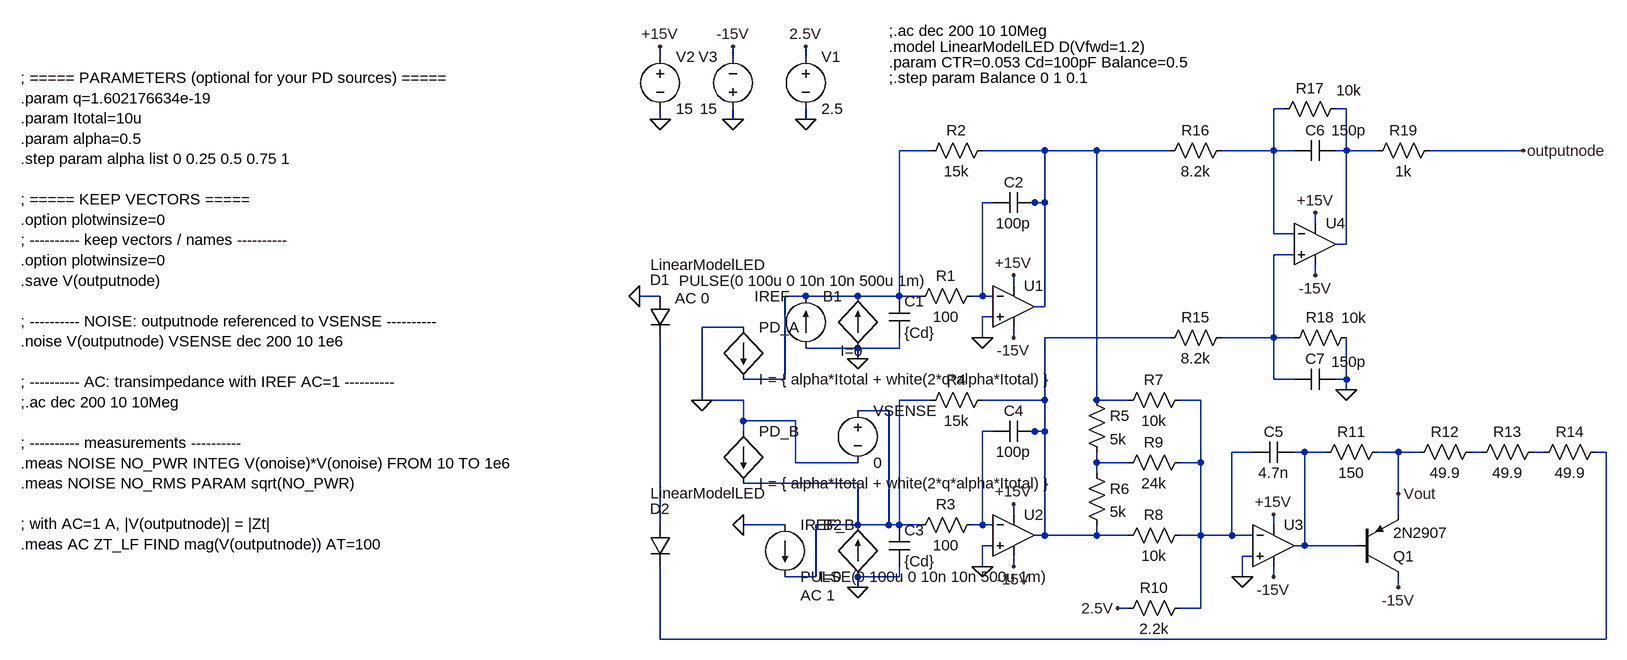
[diagram p0: schematic position-sensor-pangolin-polarity-mode-edited.asc]
position-sensor-pangolin-polarity-mode-edited.asc, the LTspice schematic file:
Version 4.1
SHEET 1 2228 1076
WIRE -144 -16 -144 -32
WIRE -32 -16 -32 -32
WIRE 80 -16 80 -32
WIRE 816 64 800 64
WIRE 912 64 896 64
WIRE -144 80 -144 64
WIRE -32 80 -32 64
WIRE 80 80 80 64
WIRE 272 128 224 128
WIRE 448 128 352 128
WIRE 528 128 448 128
WIRE 640 128 528 128
WIRE 800 128 800 64
WIRE 800 128 720 128
WIRE 832 128 800 128
WIRE 912 128 912 64
WIRE 912 128 896 128
WIRE 960 128 912 128
WIRE 1184 128 1040 128
WIRE 368 208 352 208
WIRE 432 208 416 208
WIRE 448 208 448 128
WIRE 448 208 432 208
WIRE 864 240 864 224
WIRE 800 256 800 128
WIRE 832 256 800 256
WIRE 912 272 912 128
WIRE 912 272 896 272
WIRE 832 288 800 288
WIRE 864 320 864 304
WIRE 400 336 400 320
WIRE -144 352 -176 352
WIRE 80 352 48 352
WIRE 160 352 80 352
WIRE 224 352 224 128
WIRE 224 352 160 352
WIRE 256 352 224 352
WIRE 352 352 352 208
WIRE 352 352 336 352
WIRE 368 352 352 352
WIRE 448 368 448 208
WIRE 448 368 432 368
WIRE 368 384 352 384
WIRE -16 400 -80 400
WIRE 352 416 352 384
WIRE 400 416 400 400
WIRE 640 416 448 416
WIRE 800 416 800 288
WIRE 800 416 720 416
WIRE 832 416 800 416
WIRE 160 432 80 432
WIRE 224 432 224 416
WIRE 224 432 160 432
WIRE 160 448 160 432
WIRE 48 480 48 352
WIRE 48 480 -16 480
WIRE 800 480 800 416
WIRE 832 480 800 480
WIRE 912 480 912 416
WIRE 912 480 896 480
WIRE 912 496 912 480
WIRE -80 512 -80 400
WIRE -16 512 -80 512
WIRE 272 512 224 512
WIRE 448 512 448 416
WIRE 448 512 352 512
WIRE 528 512 528 128
WIRE 576 512 528 512
WIRE 688 512 656 512
WIRE 208 528 160 528
WIRE -16 544 -16 512
WIRE 64 544 -16 544
WIRE -16 560 -16 544
WIRE 368 560 352 560
WIRE 432 560 416 560
WIRE 448 560 448 512
WIRE 448 560 432 560
WIRE 768 592 736 592
WIRE 848 592 832 592
WIRE 880 592 848 592
WIRE 992 592 960 592
WIRE 1024 592 992 592
WIRE 1120 592 1104 592
WIRE 1216 592 1200 592
WIRE 1312 592 1296 592
WIRE 64 608 64 544
WIRE 160 608 64 608
WIRE 528 608 528 592
WIRE 576 608 528 608
WIRE 688 608 688 512
WIRE 688 608 656 608
WIRE 528 624 528 608
WIRE 160 640 -16 640
WIRE 992 656 992 592
WIRE 400 688 400 672
WIRE 992 688 992 656
WIRE -144 704 -144 416
WIRE 48 704 -16 704
WIRE 160 704 160 640
WIRE 160 704 96 704
WIRE 208 704 208 528
WIRE 208 704 160 704
WIRE 224 704 224 512
WIRE 224 704 208 704
WIRE 256 704 224 704
WIRE 352 704 352 560
WIRE 352 704 336 704
WIRE 368 704 352 704
WIRE 800 704 800 688
WIRE 448 720 448 560
WIRE 448 720 432 720
WIRE 528 720 528 704
WIRE 528 720 448 720
WIRE 576 720 528 720
WIRE 688 720 688 608
WIRE 688 720 656 720
WIRE 736 720 736 592
WIRE 736 720 688 720
WIRE 768 720 736 720
WIRE 368 736 352 736
WIRE 848 736 848 592
WIRE 848 736 832 736
WIRE 928 736 848 736
WIRE 768 752 752 752
WIRE 352 768 352 736
WIRE 400 768 400 752
WIRE 96 784 96 704
WIRE 96 784 48 784
WIRE 224 784 224 768
WIRE 224 784 160 784
WIRE 752 784 752 752
WIRE 800 784 800 768
WIRE 160 800 160 784
WIRE 992 800 992 784
WIRE 576 832 560 832
WIRE 688 832 688 720
WIRE 688 832 656 832
WIRE -144 880 -144 768
WIRE 1312 880 1312 592
WIRE 1312 880 -144 880
FLAG 160 448 0
FLAG -144 80 0
FLAG -32 80 0
FLAG -144 -32 +15V
FLAG -32 -32 -15V
FLAG 400 320 +15V
FLAG 400 416 -15V
FLAG 352 416 0
FLAG 160 800 0
FLAG 400 672 +15V
FLAG 400 768 -15V
FLAG 352 768 0
FLAG -176 352 0
FLAG 80 80 0
FLAG 80 -32 2.5V
FLAG 560 832 2.5V
FLAG 800 688 +15V
FLAG 800 784 -15V
FLAG 752 784 0
FLAG 992 800 -15V
FLAG 864 224 +15V
FLAG 864 320 -15V
FLAG 912 496 0
FLAG 1184 128 outputnode
FLAG 992 656 Vout
FLAG -16 704 0
FLAG -80 512 0
DATAFLAG 448 128 ""
DATAFLAG 448 720 ""
DATAFLAG 1152 128 ""
DATAFLAG 880 736 ""
DATAFLAG 992 592 ""
DATAFLAG 1312 688 ""
DATAFLAG 1104 128 ""
SYMBOL diode -160 352 R0
WINDOW 3 1 -48 Left 2
WINDOW 0 0 -25 Left 2
SYMATTR Value LinearModelLED
SYMATTR InstName D1
SYMBOL bi 160 432 R180
WINDOW 3 -8 -4 Left 2
WINDOW 0 24 80 Left 2
SYMATTR Value I=0
SYMATTR InstName B1
SYMBOL cap 208 352 R0
SYMATTR InstName C1
SYMATTR Value {Cd}
SYMBOL OpAmps\\UniversalOpAmp 400 368 R0
SYMATTR InstName U1
SYMBOL res 352 336 R90
WINDOW 0 0 56 VBottom 2
WINDOW 3 32 56 VTop 2
SYMATTR InstName R1
SYMATTR Value 100
SYMBOL voltage -144 -32 R0
SYMATTR InstName V2
SYMATTR Value 15
SYMBOL voltage -32 80 R180
WINDOW 0 24 96 Left 2
WINDOW 3 24 16 Left 2
SYMATTR InstName V3
SYMATTR Value 15
SYMBOL res 368 112 R90
WINDOW 0 0 56 VBottom 2
WINDOW 3 32 56 VTop 2
SYMATTR InstName R2
SYMATTR Value 15k
SYMBOL cap 432 192 R90
WINDOW 0 0 32 VBottom 2
WINDOW 3 32 32 VTop 2
SYMATTR InstName C2
SYMATTR Value 100p
SYMBOL diode -160 704 R0
WINDOW 3 1 -49 Left 2
WINDOW 0 0 -25 Left 2
SYMATTR Value LinearModelLED
SYMATTR InstName D2
SYMBOL bi 160 784 R180
WINDOW 3 24 0 Left 2
WINDOW 0 24 80 Left 2
SYMATTR Value I=0
SYMATTR InstName B2
SYMBOL cap 208 704 R0
SYMATTR InstName C3
SYMATTR Value {Cd}
SYMBOL OpAmps\\UniversalOpAmp 400 720 R0
SYMATTR InstName U2
SYMBOL res 352 688 R90
WINDOW 0 0 56 VBottom 2
WINDOW 3 32 56 VTop 2
SYMATTR InstName R3
SYMATTR Value 100
SYMBOL res 368 496 R90
WINDOW 0 0 56 VBottom 2
WINDOW 3 32 56 VTop 2
SYMATTR InstName R4
SYMATTR Value 15k
SYMBOL cap 432 544 R90
WINDOW 0 0 32 VBottom 2
WINDOW 3 32 32 VTop 2
SYMATTR InstName C4
SYMATTR Value 100p
SYMBOL res 512 496 R0
SYMATTR InstName R5
SYMATTR Value 5k
SYMBOL res 512 608 R0
SYMATTR InstName R6
SYMATTR Value 5k
SYMBOL res 672 496 R90
WINDOW 0 0 56 VBottom 2
WINDOW 3 32 56 VTop 2
SYMATTR InstName R7
SYMATTR Value 10k
SYMBOL res 672 704 R90
WINDOW 0 0 56 VBottom 2
WINDOW 3 32 56 VTop 2
SYMATTR InstName R8
SYMATTR Value 10k
SYMBOL res 672 592 R90
WINDOW 0 0 56 VBottom 2
WINDOW 3 32 56 VTop 2
SYMATTR InstName R9
SYMATTR Value 24k
SYMBOL voltage 80 -32 R0
SYMATTR InstName V1
SYMATTR Value 2.5
SYMBOL res 672 816 R90
WINDOW 0 0 56 VBottom 2
WINDOW 3 32 56 VTop 2
SYMATTR InstName R10
SYMATTR Value 2.2k
SYMBOL OpAmps\\UniversalOpAmp 800 736 R0
SYMATTR InstName U3
SYMBOL cap 832 576 R90
WINDOW 0 0 32 VBottom 2
WINDOW 3 32 32 VTop 2
SYMATTR InstName C5
SYMATTR Value 4.7n
SYMBOL pnp 928 784 M180
SYMATTR InstName Q1
SYMATTR Value 2N2907
SYMBOL res 976 576 R90
WINDOW 0 0 56 VBottom 2
WINDOW 3 32 56 VTop 2
SYMATTR InstName R11
SYMATTR Value 150
SYMBOL res 1120 576 R90
WINDOW 0 0 56 VBottom 2
WINDOW 3 32 56 VTop 2
SYMATTR InstName R12
SYMATTR Value 49.9
SYMBOL res 1216 576 R90
WINDOW 0 0 56 VBottom 2
WINDOW 3 32 56 VTop 2
SYMATTR InstName R13
SYMATTR Value 49.9
SYMBOL res 1312 576 R90
WINDOW 0 0 56 VBottom 2
WINDOW 3 32 56 VTop 2
SYMATTR InstName R14
SYMATTR Value 49.9
SYMBOL OpAmps\\UniversalOpAmp 864 272 R0
SYMATTR InstName U4
SYMBOL cap 896 112 R90
WINDOW 0 0 32 VBottom 2
WINDOW 3 -31 -20 VTop 2
SYMATTR InstName C6
SYMATTR Value 150p
SYMBOL res 736 400 R90
WINDOW 0 0 56 VBottom 2
WINDOW 3 32 56 VTop 2
SYMATTR InstName R15
SYMATTR Value 8.2k
SYMBOL res 736 112 R90
WINDOW 0 0 56 VBottom 2
WINDOW 3 32 56 VTop 2
SYMATTR InstName R16
SYMATTR Value 8.2k
SYMBOL res 912 48 R90
WINDOW 0 0 56 VBottom 2
WINDOW 3 -28 -4 VTop 2
SYMATTR InstName R17
SYMATTR Value 10k
SYMBOL res 928 400 R90
WINDOW 0 0 56 VBottom 2
WINDOW 3 -30 4 VTop 2
SYMATTR InstName R18
SYMATTR Value 10k
SYMBOL cap 896 464 R90
WINDOW 0 0 32 VBottom 2
WINDOW 3 -27 -20 VTop 2
SYMATTR InstName C7
SYMATTR Value 150p
SYMBOL res 1056 112 R90
WINDOW 0 0 56 VBottom 2
WINDOW 3 32 56 VTop 2
SYMATTR InstName R19
SYMATTR Value 1k
SYMBOL current 80 432 R180
WINDOW 0 24 80 Left 2
WINDOW 3 -190 104 Left 2
WINDOW 123 148 77 Left 2
WINDOW 39 0 0 Left 0
SYMATTR InstName IREF
SYMATTR Value PULSE(0 100u 0 10n 10n 500u 1m)
SYMATTR Value2 AC 0
SYMBOL current 48 704 R0
WINDOW 123 24 108 Left 2
WINDOW 39 0 0 Left 0
SYMATTR Value2 AC 1
SYMATTR InstName IREF_B
SYMATTR Value PULSE(0 100u 0 10n 10n 500u 1m)
SYMBOL bi -16 400 R0
SYMATTR InstName PD_A
SYMATTR Value I = { alpha*Itotal + white(2*q*alpha*Itotal) }
SYMBOL bi -16 560 R0
SYMATTR InstName PD_B
SYMATTR Value I = { alpha*Itotal + white(2*q*alpha*Itotal) }
SYMBOL voltage 160 512 R0
WINDOW 123 0 0 Left 0
WINDOW 39 0 0 Left 0
SYMATTR InstName VSENSE
SYMATTR Value 0
TEXT 208 -32 Left 2 !.model LinearModelLED D(Vfwd=1.2)
TEXT 208 -8 Left 2 !.param CTR=0.053 Cd=100pF Balance=0.5
TEXT 208 16 Left 2 !;.step param Balance 0 1 0.1
TEXT 208 -56 Left 2 !;.ac dec 200 10 10Meg
TEXT -1128 16 Left 2 !; ===== PARAMETERS (optional for your PD sources) =====\n.param q=1.602176634e-19\n.param Itotal=10u\n.param alpha=0.5\n.step param alpha list 0 0.25 0.5 0.75 1\n \n; ===== KEEP VECTORS =====\n.option plotwinsize=0\n; ---------- keep vectors / names ----------\n.option plotwinsize=0\n.save V(outputnode)\n \n; ---------- NOISE: outputnode referenced to VSENSE ----------\n.noise V(outputnode) VSENSE dec 200 10 1e6\n \n; ---------- AC: transimpedance with IREF AC=1 ----------\n;.ac dec 200 10 10Meg\n \n; ---------- measurements ----------\n.meas NOISE NO_PWR INTEG V(onoise)*V(onoise) FROM 10 TO 1e6\n.meas NOISE NO_RMS PARAM sqrt(NO_PWR)\n \n; with AC=1 A, |V(outputnode)| = |Zt|\n.meas AC ZT_LF FIND mag(V(outputnode)) AT=100

The netlist it stands for:
* position-sensor-pangolin-polarity-mode-edited.asc
D1 0 N016 LinearModelLED
B1 0 N003 I=0
C1 N003 0 {Cd}
X§U1 0 N005 +15V -15V N004 level1 Avol=1Meg GBW=10Meg Vos=0 En=0 Enk=0 In=0 Ink=0 Rin=500Meg  ; pins In+ In- V+ V- OUT
R1 N005 N003 100
V2 +15V 0 15
V3 0 -15V 15
R2 N004 N003 15k
C2 N004 N005 100p
D2 N016 N014 LinearModelLED
B2 0 N008 I=0
C3 N008 0 {Cd}
X§U2 0 N010 +15V -15V N007 level1 Avol=1Meg GBW=10Meg Vos=0 En=0 Enk=0 In=0 Ink=0 Rin=500Meg  ; pins In+ In- V+ V- OUT
R3 N010 N008 100
R4 N007 N008 15k
C4 N007 N010 100p
R5 N004 N015 5k
R6 N015 N007 5k
R7 N009 N004 10k
R8 N009 N007 10k
R9 N009 N015 24k
V1 2.5V 0 2.5
R10 N009 2.5V 2.2k
X§U3 0 N009 +15V -15V N011 level1 Avol=1Meg GBW=10Meg Vos=0 En=0 Enk=0 In=0 Ink=0 Rin=500Meg  ; pins In+ In- V+ V- OUT
C5 N011 N009 4.7n
Q1 -15V N011 Vout 0 2N2907
R11 Vout N011 150
R12 N012 Vout 49.9
R13 N013 N012 49.9
R14 N014 N013 49.9
X§U4 N006 N001 +15V -15V N002 level1 Avol=1Meg GBW=10Meg Vos=0 En=0 Enk=0 In=0 Ink=0 Rin=500Meg  ; pins In+ In- V+ V- OUT
C6 N002 N001 150p
R15 N006 N007 8.2k
R16 N001 N004 8.2k
R17 N002 N001 10k
R18 0 N006 10k
C7 0 N006 150p
R19 outputnode N002 1k
IREF 0 N003 PULSE(0 100u 0 10n 10n 500u 1m) AC 0
IREF_B 0 N008 PULSE(0 100u 0 10n 10n 500u 1m) AC 1
B§PD_A 0 N003 I = { alpha*Itotal + white(2*q*alpha*Itotal) }
B§PD_B 0 N008 I = { alpha*Itotal + white(2*q*alpha*Itotal) }
VSENSE N008 0 0
.model D D
.lib standard.dio
.model NPN NPN
.model PNP PNP
.lib standard.bjt
.model LinearModelLED D(Vfwd=1.2)
.param CTR=0.053 Cd=100pF Balance=0.5
;.step param Balance 0 1 0.1
;.ac dec 200 10 10Meg
; ===== PARAMETERS (optional for your PD sources) =====
.param q=1.602176634e-19
.param Itotal=10u
.param alpha=0.5
.step param alpha list 0 0.25 0.5 0.75 1
; ===== KEEP VECTORS =====
.option plotwinsize=0
; ---------- keep vectors / names ----------
.option plotwinsize=0
.save V(outputnode)
; ---------- NOISE: outputnode referenced to VSENSE ----------
.noise V(outputnode) VSENSE dec 200 10 1e6
; ---------- AC: transimpedance with IREF AC=1 ----------
;.ac dec 200 10 10Meg
; ---------- measurements ----------
.meas NOISE NO_PWR INTEG V(onoise)*V(onoise) FROM 10 TO 1e6
.meas NOISE NO_RMS PARAM sqrt(NO_PWR)
; with AC=1 A, |V(outputnode)| = |Zt|
.meas AC ZT_LF FIND mag(V(outputnode)) AT=100
.lib UniversalOpAmp1.lib
.backanno
.end